# Altium schematic sheet WAV_Player.SchDoc
size B; Organization: Altium Limited; Address1: L3, 12a Rodborough Rd; Address2: Frenchs Forest; Address3: NSW; Address4: Australia 2086; DocumentNumber: 1; SheetNumber: 1; SheetTotal: 2
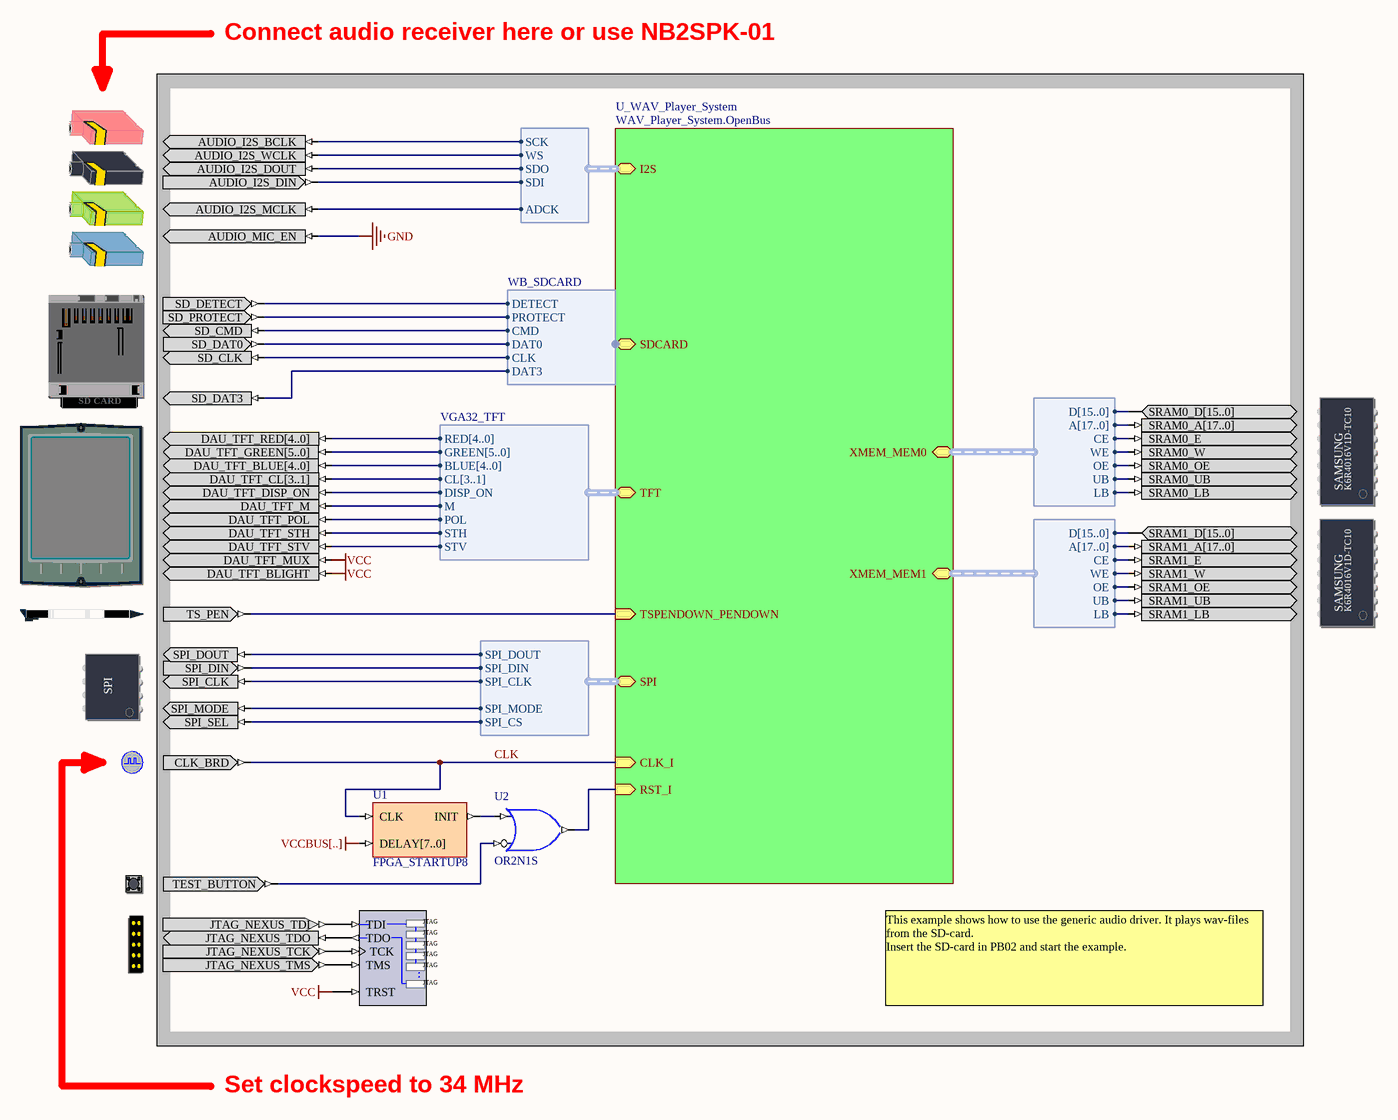
[diagram p0: WAV_Player.SchDoc]

## Parts
(Parts that share a designator on the sheet are numbered #1, #2 ... from top to bottom, then left to right.)
?#1  AUDIO_CODEC  (value not drawn)
?#2  SD_CARD  (value not drawn)
?#3  SRAM_DAUGHTER0  (value not drawn)
?#4  TFT_LCD  (value not drawn)
?#5  SRAM_DAUGHTER1  (value not drawn)
?#6  TOUCHSCREEN_PEN_DOWN  (value not drawn)
?#7  SPI_BUS  (value not drawn)
?#8  CLOCK_BOARD  (value not drawn)
?#9  TEST_BUTTON  (value not drawn)
?#10  NEXUS_JTAG_CONNECTOR  (value not drawn)
NEXUS_JTAG_PORT  NEXUS_JTAG_PORT  (value not drawn)
U1  FPGA_STARTUP8
U2  OR2N1S

## Sub-sheets
U_WAV_Player_System = WAV_Player_System.OpenBus: CLK_I (in), RST_I (in), I2S (harness I2S_W_Both), XMEM_MEM0 (harness WB_MEM_CTRL_SRAM16_A18), XMEM_MEM1 (harness WB_MEM_CTRL_SRAM16_A18), TFT (harness VGA32_TFT), TSPENDOWN_PENDOWN (in), SDCARD (harness WB_SDCARD), SPI (harness SPI_W_NB)

## Harnesses
I2S_W_Both: SCK, WS, SDO, SDI, ADCK
WB_MEM_CTRL_SRAM16_A18: D[15..0], A[17..0], CE, WE, OE, UB, LB
VGA32_TFT: RED[4..0], GREEN[5..0], BLUE[4..0], CL[3..1], DISP_ON, M, POL, STH, STV
WB_SDCARD: DETECT, PROTECT, CMD, DAT0, CLK, DAT3
SPI_W_NB: SPI_DOUT, SPI_DIN, SPI_CLK, SPI_CS, SPI_MODE

## Nets
GND: ?#1.AUDIO_MIC_EN
VCC: ?#4.DAU_TFT_BLIGHT ?#4.DAU_TFT_MUX NEXUS_JTAG_PORT.TRST
VCCBUS[..]: U1.DELAY[7..0]
CLK: ?#8.CLK_BRD U1.CLK ; sheet U_WAV_Player_System/CLK_I
Net?#1_AUDIO_I2S_BCLK: ?#1.AUDIO_I2S_BCLK ; sheet U_WAV_Player_System/I2S.SCK
Net?#1_AUDIO_I2S_DIN: ?#1.AUDIO_I2S_DIN ; sheet U_WAV_Player_System/I2S.SDI
Net?#1_AUDIO_I2S_DOUT: ?#1.AUDIO_I2S_DOUT ; sheet U_WAV_Player_System/I2S.SDO
Net?#1_AUDIO_I2S_MCLK: ?#1.AUDIO_I2S_MCLK ; sheet U_WAV_Player_System/I2S.ADCK
Net?#1_AUDIO_I2S_WCLK: ?#1.AUDIO_I2S_WCLK ; sheet U_WAV_Player_System/I2S.WS
Net?#2_SD_CLK: ?#2.SD_CLK ; sheet U_WAV_Player_System/SDCARD.CLK
Net?#2_SD_CMD: ?#2.SD_CMD ; sheet U_WAV_Player_System/SDCARD.CMD
Net?#2_SD_DAT0: ?#2.SD_DAT0 ; sheet U_WAV_Player_System/SDCARD.DAT0
Net?#2_SD_DAT3: ?#2.SD_DAT3 ; sheet U_WAV_Player_System/SDCARD.DAT3
Net?#2_SD_DETECT: ?#2.SD_DETECT ; sheet U_WAV_Player_System/SDCARD.DETECT
Net?#2_SD_PROTECT: ?#2.SD_PROTECT ; sheet U_WAV_Player_System/SDCARD.PROTECT
Net?#3_SRAM0_A[17..0]: ?#3.SRAM0_A[17..0] ; sheet U_WAV_Player_System/XMEM_MEM0.A[17..0]
Net?#3_SRAM0_D[15..0]: ?#3.SRAM0_D[15..0] ; sheet U_WAV_Player_System/XMEM_MEM0.D[15..0]
Net?#3_SRAM0_E: ?#3.SRAM0_E ; sheet U_WAV_Player_System/XMEM_MEM0.CE
Net?#3_SRAM0_LB: ?#3.SRAM0_LB ; sheet U_WAV_Player_System/XMEM_MEM0.LB
Net?#3_SRAM0_OE: ?#3.SRAM0_OE ; sheet U_WAV_Player_System/XMEM_MEM0.OE
Net?#3_SRAM0_UB: ?#3.SRAM0_UB ; sheet U_WAV_Player_System/XMEM_MEM0.UB
Net?#3_SRAM0_W: ?#3.SRAM0_W ; sheet U_WAV_Player_System/XMEM_MEM0.WE
Net?#4_DAU_TFT_BLUE[4..0]: ?#4.DAU_TFT_BLUE[4..0] ; sheet U_WAV_Player_System/TFT.BLUE[4..0]
Net?#4_DAU_TFT_CL[3..1]: ?#4.DAU_TFT_CL[3..1] ; sheet U_WAV_Player_System/TFT.CL[3..1]
Net?#4_DAU_TFT_DISP_ON: ?#4.DAU_TFT_DISP_ON ; sheet U_WAV_Player_System/TFT.DISP_ON
Net?#4_DAU_TFT_GREEN[5..0]: ?#4.DAU_TFT_GREEN[5..0] ; sheet U_WAV_Player_System/TFT.GREEN[5..0]
Net?#4_DAU_TFT_M: ?#4.DAU_TFT_M ; sheet U_WAV_Player_System/TFT.M
Net?#4_DAU_TFT_POL: ?#4.DAU_TFT_POL ; sheet U_WAV_Player_System/TFT.POL
Net?#4_DAU_TFT_RED[4..0]: ?#4.DAU_TFT_RED[4..0] ; sheet U_WAV_Player_System/TFT.RED[4..0]
Net?#4_DAU_TFT_STH: ?#4.DAU_TFT_STH ; sheet U_WAV_Player_System/TFT.STH
Net?#4_DAU_TFT_STV: ?#4.DAU_TFT_STV ; sheet U_WAV_Player_System/TFT.STV
Net?#5_SRAM1_A[17..0]: ?#5.SRAM1_A[17..0] ; sheet U_WAV_Player_System/XMEM_MEM1.A[17..0]
Net?#5_SRAM1_D[15..0]: ?#5.SRAM1_D[15..0] ; sheet U_WAV_Player_System/XMEM_MEM1.D[15..0]
Net?#5_SRAM1_E: ?#5.SRAM1_E ; sheet U_WAV_Player_System/XMEM_MEM1.CE
Net?#5_SRAM1_LB: ?#5.SRAM1_LB ; sheet U_WAV_Player_System/XMEM_MEM1.LB
Net?#5_SRAM1_OE: ?#5.SRAM1_OE ; sheet U_WAV_Player_System/XMEM_MEM1.OE
Net?#5_SRAM1_UB: ?#5.SRAM1_UB ; sheet U_WAV_Player_System/XMEM_MEM1.UB
Net?#5_SRAM1_W: ?#5.SRAM1_W ; sheet U_WAV_Player_System/XMEM_MEM1.WE
Net?#6_TS_PEN: ?#6.TS_PEN ; sheet U_WAV_Player_System/TSPENDOWN_PENDOWN
Net?#7_SPI_CLK: ?#7.SPI_CLK ; sheet U_WAV_Player_System/SPI.SPI_CLK
Net?#7_SPI_DIN: ?#7.SPI_DIN ; sheet U_WAV_Player_System/SPI.SPI_DIN
Net?#7_SPI_DOUT: ?#7.SPI_DOUT ; sheet U_WAV_Player_System/SPI.SPI_DOUT
Net?#7_SPI_MODE: ?#7.SPI_MODE ; sheet U_WAV_Player_System/SPI.SPI_MODE
Net?#7_SPI_SEL: ?#7.SPI_SEL ; sheet U_WAV_Player_System/SPI.SPI_CS
Net?#9_TEST_BUTTON: ?#9.TEST_BUTTON U2.I0
Net?#10_JTAG_NEXUS_TCK: ?#10.JTAG_NEXUS_TCK NEXUS_JTAG_PORT.TCK
Net?#10_JTAG_NEXUS_TDI: ?#10.JTAG_NEXUS_TDI NEXUS_JTAG_PORT.TDI
Net?#10_JTAG_NEXUS_TDO: ?#10.JTAG_NEXUS_TDO NEXUS_JTAG_PORT.TDO
Net?#10_JTAG_NEXUS_TMS: ?#10.JTAG_NEXUS_TMS NEXUS_JTAG_PORT.TMS
NetU1_INIT: U1.INIT U2.I1
NetU2_O: U2.O ; sheet U_WAV_Player_System/RST_I

## Notes on the sheet
- Connect audio receiver here or use NB2SPK-01
- This example shows how to use the generic audio driver. It plays wav-files from the SD-card.
  Insert the SD-card in PB02 and start the example.
- Set clockspeed to 34 MHz
- Title
- Size:
- Date:
- B
- Number:
- Time:
- Revision:
- Sheet
- of
- File:
- (in symbol NEXUS_JTAG_PORT) .
- (in symbol SD_CARD) SD CARD
- (in symbol SPI_BUS) SPI
- (in symbol SRAM_DAUGHTER0) SAMSUNG; K6R4016V1D-TC10
- (in symbol SRAM_DAUGHTER1) SAMSUNG; K6R4016V1D-TC10

## Library data of the parts
?#1 = AUDIO_CODEC: Audio Codec; PortComponent: True; IncludeInDSF: AUDIO_CS4270; Published: 22-Jan-2007; Publisher: Altium Limited; HelpURL: TR0145 Technical Reference for Altium's Audio-Video Peripheral Board PB01.pdf#page=12
?#2 = SD_CARD: Secure Digital Card Socket; PortComponent: True; Published: 22-Jan-2007; Publisher: Altium Limited; UseInDSF: True; HelpURL: TR0146 Technical Reference for Altium's Mass Storage Peripheral Board PB02.pdf#page=7
?#3 = SRAM_DAUGHTER0: Free Static RAM - Daughterboard; PortComponent: True; Published: 14-May-2007; Publisher: Altium Limited; HelpURL: TR0149 Technical Reference for Altium's Xilinx Spartan-3 Daughter Board DB30.pdf#page=16
?#4 = TFT_LCD: TFT LCD Panel; PortComponent: True; Published: 22-Jan-2007; Publisher: Altium Limited; HelpURL: TR0143 Technical Reference Manual for Altium's Desktop NanoBoard NB2DSK01.pdf#page=50
?#5 = SRAM_DAUGHTER1: Free Static RAM - Daughterboard; PortComponent: True; Published: 14-May-2007; Publisher: Altium Limited; HelpURL: TR0149 Technical Reference for Altium's Xilinx Spartan-3 Daughter Board DB30.pdf#page=16
?#6 = TOUCH_SCREEN_PEN: TFT Touch Screen Pen; PortComponent: True; Published: 22-Jan-2007; Publisher: Altium Limited; HelpURL: TR0143 Technical Reference Manual for Altium's Desktop NanoBoard NB2DSK01.pdf#page=50
?#7 = SPI_BUS: Generic SPI Bus; PortComponent: True; Published: 22-Jan-2007; Publisher: Altium Limited; HelpURL: TR0143 Technical Reference Manual for Altium's Desktop NanoBoard NB2DSK01.pdf#page=55
?#8 = CLOCK_BOARD: Global System Clock Supply; PortComponent: True; Published: 19-Nov-2003; Publisher: Altium Limited; HelpURL: TR0143 Technical Reference Manual for Altium's Desktop NanoBoard NB2DSK01.pdf#page=41; UseInDSF: True
?#9 = TEST_BUTTON: Test / Reset Button; PortComponent: True; Published: 19-Nov-2003; Publisher: Altium Limited; HelpURL: TR0143 Technical Reference Manual for Altium's Desktop NanoBoard NB2DSK01.pdf#page=53
?#10 = NEXUS_JTAG_CONNECTOR: JTAG Port; PortComponent: True; Published: 19-Nov-2003; Publisher: Altium Limited; HelpURL: TR0143 NanoBoard Technical Reference Manual - NB2.pdf#page=48
NEXUS_JTAG_PORT = NEXUS_JTAG_PORT: Soft Nexus-Chain Connector; NEXUS_JTAG_CONNECTOR: True; FunctionalClass: JTAG; Published: 29-Jan-2004; Publisher: Altium Limited; LastRevisionNo: 1.00.00; HelpURL: CR0118 FPGA Generic Library Guide.pdf#page=405
U1 = FPGA_STARTUP8: FPGA Startup With 8 Bit Delay; Published: 9-Dec-2004; Publisher: Altium Limited; HelpURL: CR0119 FPGA_STARTUPx Powerup Delay Unit.pdf; LastRevisionNo: 1.00.00; ComponentLink1Description: Core &Resource Usage; ComponentLink1URL: CR0139 FPGA Peripheral Resource Usage.pdf#page=11
U2 = OR2N1S: 2-Input OR Gate with Active Low A Input, Single Pin Version; XilinxEquivalent: OR2B1; FunctionalClass: Logic Primitive; PortSize: 2; ArchiveName: GENERIC; VHDLIB_SIM: GENERIC_LIB; Published: 29-Jan-2004; Publisher: Altium Limited; LastRevisionNo: 1.00.00; HelpURL: CR0118 FPGA Generic Library Guide.pdf#page=410; ComponentLink1URL: CR0136 FPGA Logic Primitive Resource Usage.pdf#page=187; ComponentLink1Description: Core &Resource Usage; SubClass: OR; PortStyle: Single Pin Version